# Altium schematic sheet [11] - LAN.SchDoc
size A3; DocumentNumber: 11; SheetNumber: 11; SheetTotal: 14
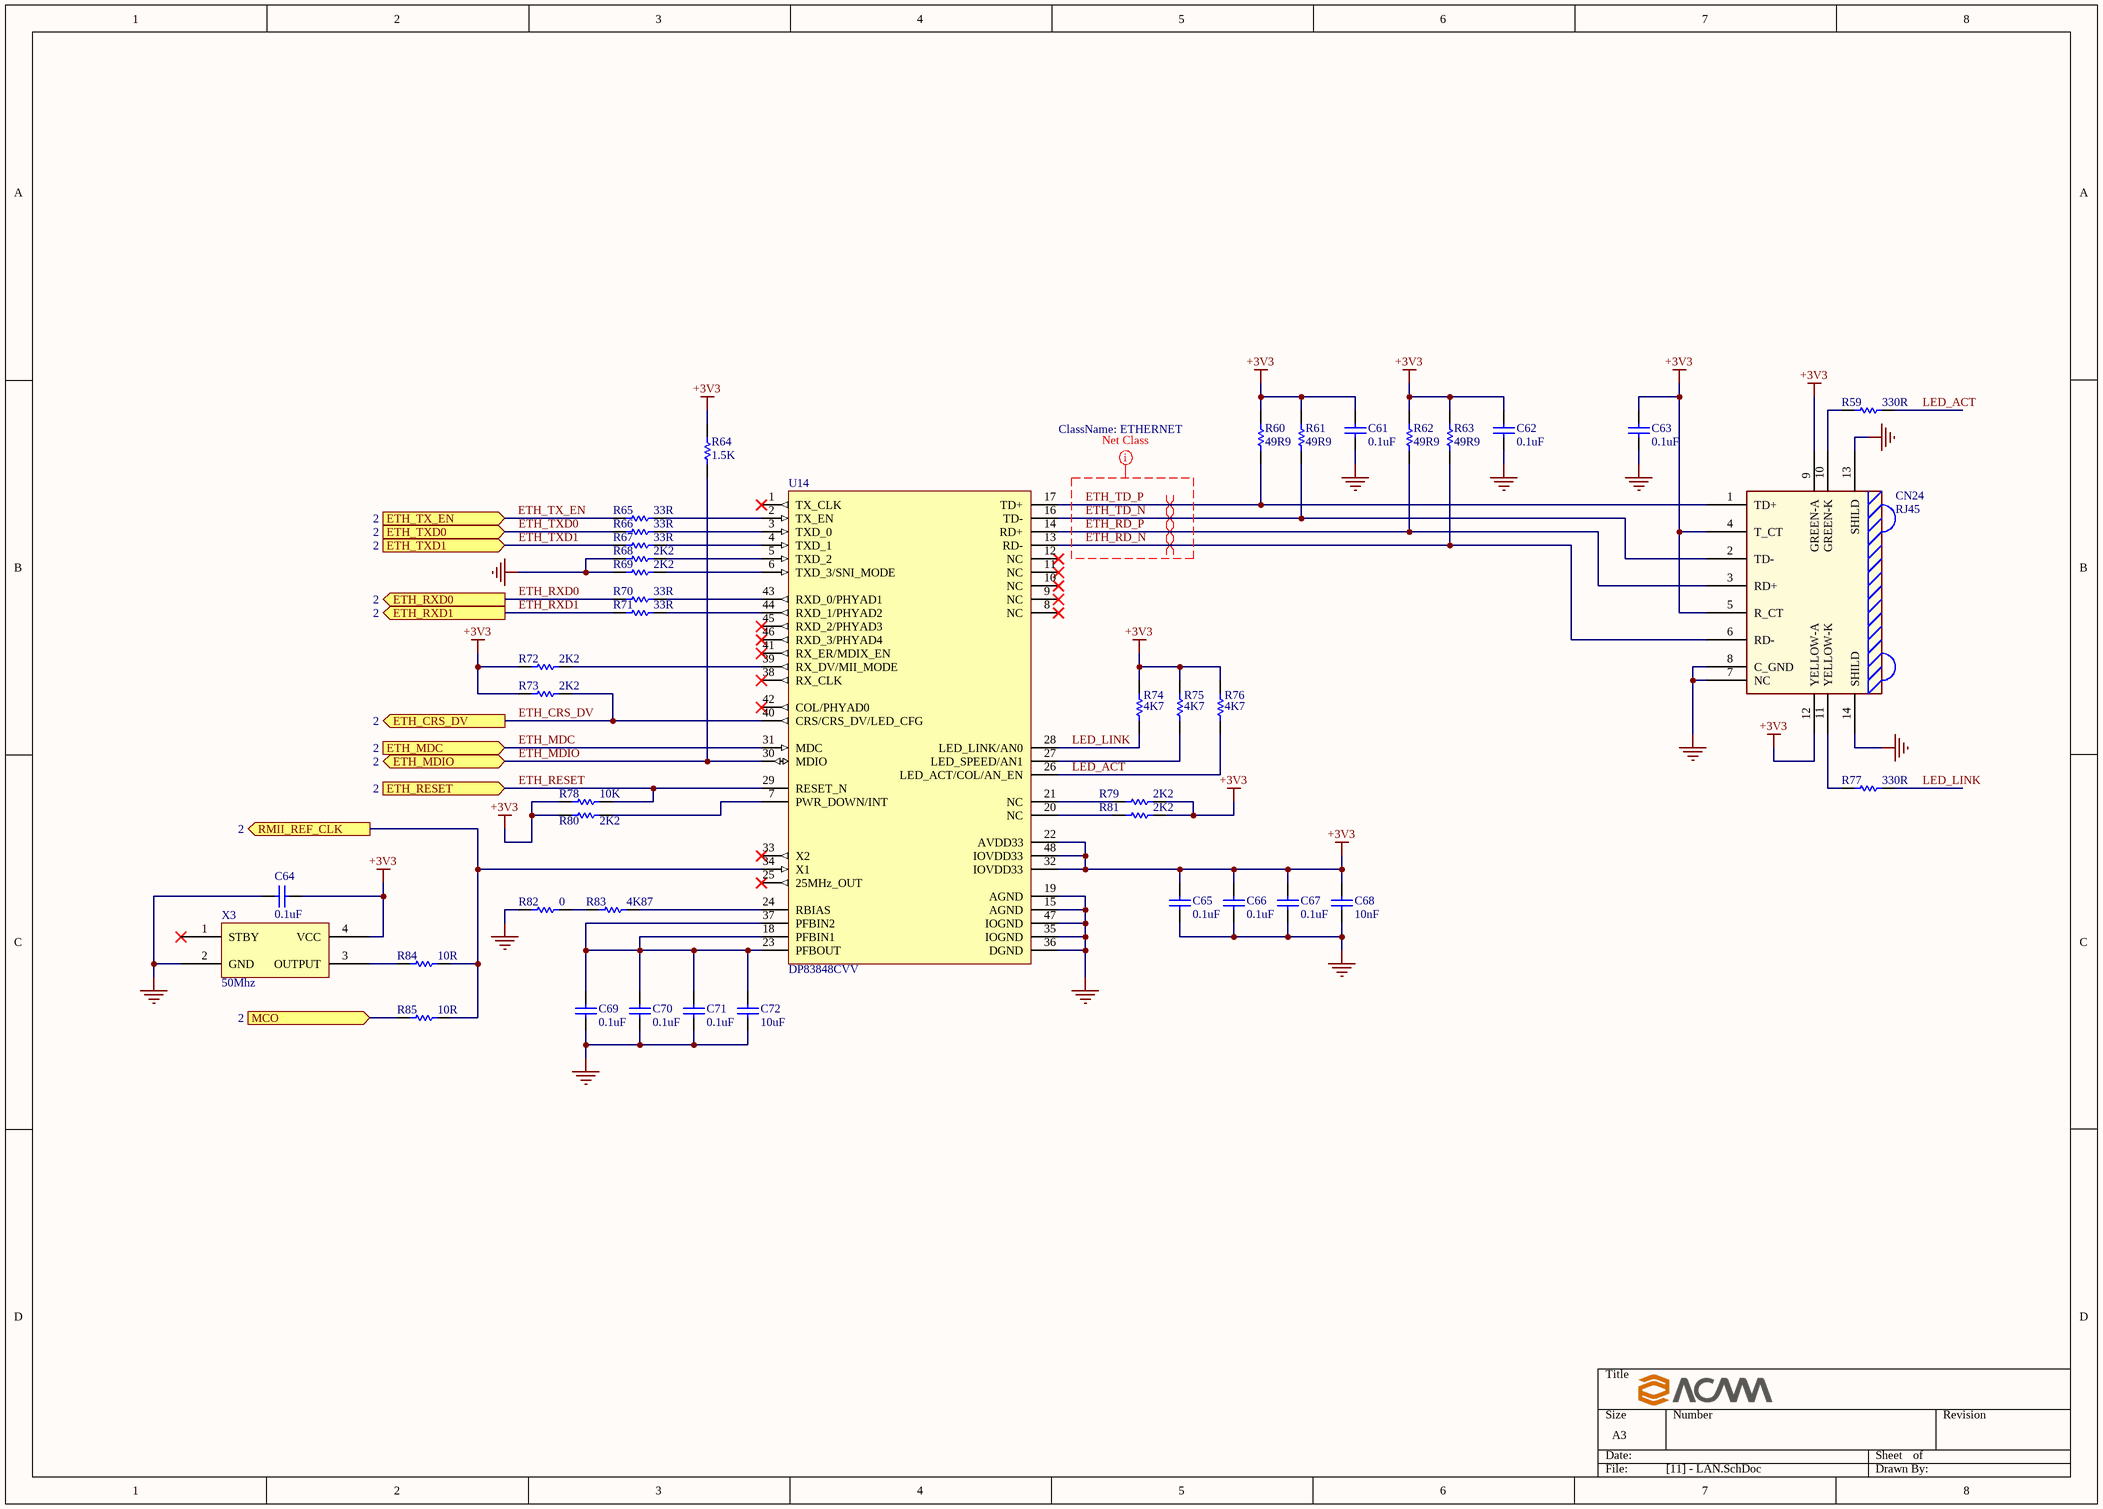
[diagram p0: [11] - LAN.SchDoc]

## Parts
C61  0.1uF  [0402_C]
C62  0.1uF  [0402_C]
C63  0.1uF  [0402_C]
C64  0.1uF  [0402_C]
C65  0.1uF  [0402_C]
C66  0.1uF  [0402_C]
C67  0.1uF  [0402_C]
C68  10nF  [0402_C]
C69  0.1uF  [0402_C]
C70  0.1uF  [0402_C]
C71  0.1uF  [0402_C]
C72  10uF  [0402_C]
CN24  RJ45  [HR911105A]
R59  330R  [0402_R]
R60  49R9  [0402_R]
R61  49R9  [0402_R]
R62  49R9  [0402_R]
R63  49R9  [0402_R]
R64  1.5K  [0402_R]
R65  33R  [0402_R]
R66  33R  [0402_R]
R67  33R  [0402_R]
R68  2K2  [0402_R]
R69  2K2  [0402_R]
R70  33R  [0402_R]
R71  33R  [0402_R]
R72  2K2  [0402_R]
R73  2K2  [0402_R]
R74  4K7  [0402_R]
R75  4K7  [0402_R]
R76  4K7  [0402_R]
R77  330R  [0402_R]
R78  10K  [0402_R]
R79  2K2  [0402_R]
R80  2K2  [0402_R]
R81  2K2  [0402_R]
R82  0  [0402_R]
R83  4K87  [0402_R]
R84  10R  [0402_R]
R85  10R  [0402_R]
U14  DP83848CVV  [TQFP48_M]
X3  50Mhz  [OSC_3.2x2.5]

## Ports
ETH_CRS_DV (out, see 2), ETH_MDC (in, see 2), ETH_MDIO (bidir, see 2), ETH_RESET (in, see 2), ETH_RXD0 (out, see 2), ETH_RXD1 (out, see 2), ETH_TX_EN (in, see 2), ETH_TXD0 (in, see 2), ETH_TXD1 (in, see 2), MCO (in, see 2), RMII_REF_CLK (out, see 2)

## Nets
+3V3: C61.2 C62.2 C63.2 C64.1 C65.1 C66.1 C67.1 C68.1 CN24.4(T_CT) CN24.5(R_CT) CN24.9(GREEN-A) CN24.12(YELLOW-A) R60.2 R61.2 R62.2 R63.2 R64.2 R72.1 R73.1 R74.2 R75.2 R76.2 R78.1 R79.2 R80.1 R81.2 U14.22(AVDD33) U14.32(IOVDD33) U14.48(IOVDD33) X3.4(VCC)
GND: C61.1 C62.1 C63.1 C64.2 C65.2 C66.2 C67.2 C68.2 C69.1 C70.1 C71.1 C72.1 CN24.7(NC) CN24.8(C_GND) CN24.13(SHILD) CN24.14(SHILD) R68.1 R69.1 R82.1 U14.15(AGND) U14.19(AGND) U14.35(IOGND) U14.36(DGND) U14.47(IOGND) X3.2(GND)
ETH_CRS_DV: R73.2 U14.40(CRS/CRS_DV/LED_CFG) ; port ETH_CRS_DV
ETH_MDC: U14.31(MDC) ; port ETH_MDC
ETH_MDIO: R64.1 U14.30(MDIO) ; port ETH_MDIO
ETH_RD_N: CN24.6(RD-) R63.1 U14.13(RD-)
ETH_RD_P: CN24.3(RD+) R62.1 U14.14(RD+)
ETH_RESET: R78.2 U14.29(RESET_N) ; port ETH_RESET
ETH_RXD0: R70.1 ; port ETH_RXD0
ETH_RXD1: R71.1 ; port ETH_RXD1
ETH_TD_N: CN24.2(TD-) R61.1 U14.16(TD-)
ETH_TD_P: CN24.1(TD+) R60.1 U14.17(TD+)
ETH_TX_EN: R65.1 ; port ETH_TX_EN
ETH_TXD0: R66.1 ; port ETH_TXD0
ETH_TXD1: R67.1 ; port ETH_TXD1
LED_ACT: R59.2 R76.1 U14.26(LED_ACT/COL/AN_EN)
LED_LINK: R74.1 R77.2 U14.28(LED_LINK/AN0)
MCO: R85.1 ; port MCO
RMII_REF_CLK: R84.2 R85.2 U14.34(X1) ; port RMII_REF_CLK
NetC69_2: C69.2 C70.2 C71.2 C72.2 U14.18(PFBIN1) U14.23(PFBOUT) U14.37(PFBIN2)
NetCN24_10: CN24.10(GREEN-K) R59.1
NetCN24_11: CN24.11(YELLOW-K) R77.1
NetR65_2: R65.2 U14.2(TX_EN)
NetR66_2: R66.2 U14.3(TXD_0)
NetR67_2: R67.2 U14.4(TXD_1)
NetR68_2: R68.2 U14.5(TXD_2)
NetR69_2: R69.2 U14.6(TXD_3/SNI_MODE)
NetR70_2: R70.2 U14.43(RXD_0/PHYAD1)
NetR71_2: R71.2 U14.44(RXD_1/PHYAD2)
NetR72_2: R72.2 U14.39(RX_DV/MII_MODE)
NetR75_1: R75.1 U14.27(LED_SPEED/AN1)
NetR79_1: R79.1 U14.21(NC)
NetR80_2: R80.2 U14.7(PWR_DOWN/INT)
NetR81_1: R81.1 U14.20(NC)
NetR82_2: R82.2 R83.1
NetR83_2: R83.2 U14.24(RBIAS)
NetR84_1: R84.1 X3.3(OUTPUT)

Not connected (* = marked no-connect by the designer): U14 1(TX_CLK)* 8(NC)* 9(NC)* 10(NC)* 11(NC)* 12(NC)* 25(25MHz_OUT)* 33(X2)* 38(RX_CLK)* 41(RX_ER/MDIX_EN)* 42(COL/PHYAD0)* 45(RXD_2/PHYAD3)* 46(RXD_3/PHYAD4)*; X3 1(STBY)*

## Layout directives
net class ETHERNET: ETH_RD_N, ETH_RD_P, ETH_TD_N, ETH_TD_P
differential pair; differential pair class DIFF100: ETH_RD_N, ETH_RD_P, ETH_TD_N, ETH_TD_P

## Library data of the parts
C61-C72 = Cap SMD: Non-Pol SMD Capacitor; RATED_VOLTAGE: 16V; Manufacturer Part Num: *
  C61-C67 C69-C71: Value: 0.1uF
  C68: Value: 10nF
  C72: Value: 10uF
CN24 = RJ45 Connector #1: RJ45 Socket with Magnet and LED; value: RJ45; Manufacturer Part Num: HR911105A
R59-R77 R79-R81 = Res SMD: SMD Resistor; Tolerance: 1%; Manufacturer Part Num: *
  R59 R77: Value: 330R
  R60-R63: Value: 49R9
  R64: Value: 1.5K
  R65-R67 R70 R71: Value: 33R
  R68 R69 R72 R73 R79-R81: Value: 2K2
  R74-R76: Value: 4K7
R78 R82 R84 R85 = Res SMD: SMD Resistor; Tolerance: 5%; Manufacturer Part Num: *
  R78: Value: 10K
  R82: Value: 0
  R84 R85: Value: 10R
R83 = Res SMD: SMD Resistor; Manufacturer Part Num: RC0402FR-074K87L; Tolerance: 1%; Value: 4K87
U14 = DP83848: 10/100 Mbps Ethernet PHY; Value: DP83848CVV
X3 = XTAL OSC: Crystal Oscillator; Manufacturer Part Num: ECS-3225S33-500-FN-TR; Value: 50Mhz